# EAGLE design Suport 0.1 (EAGLE 9.6.2)
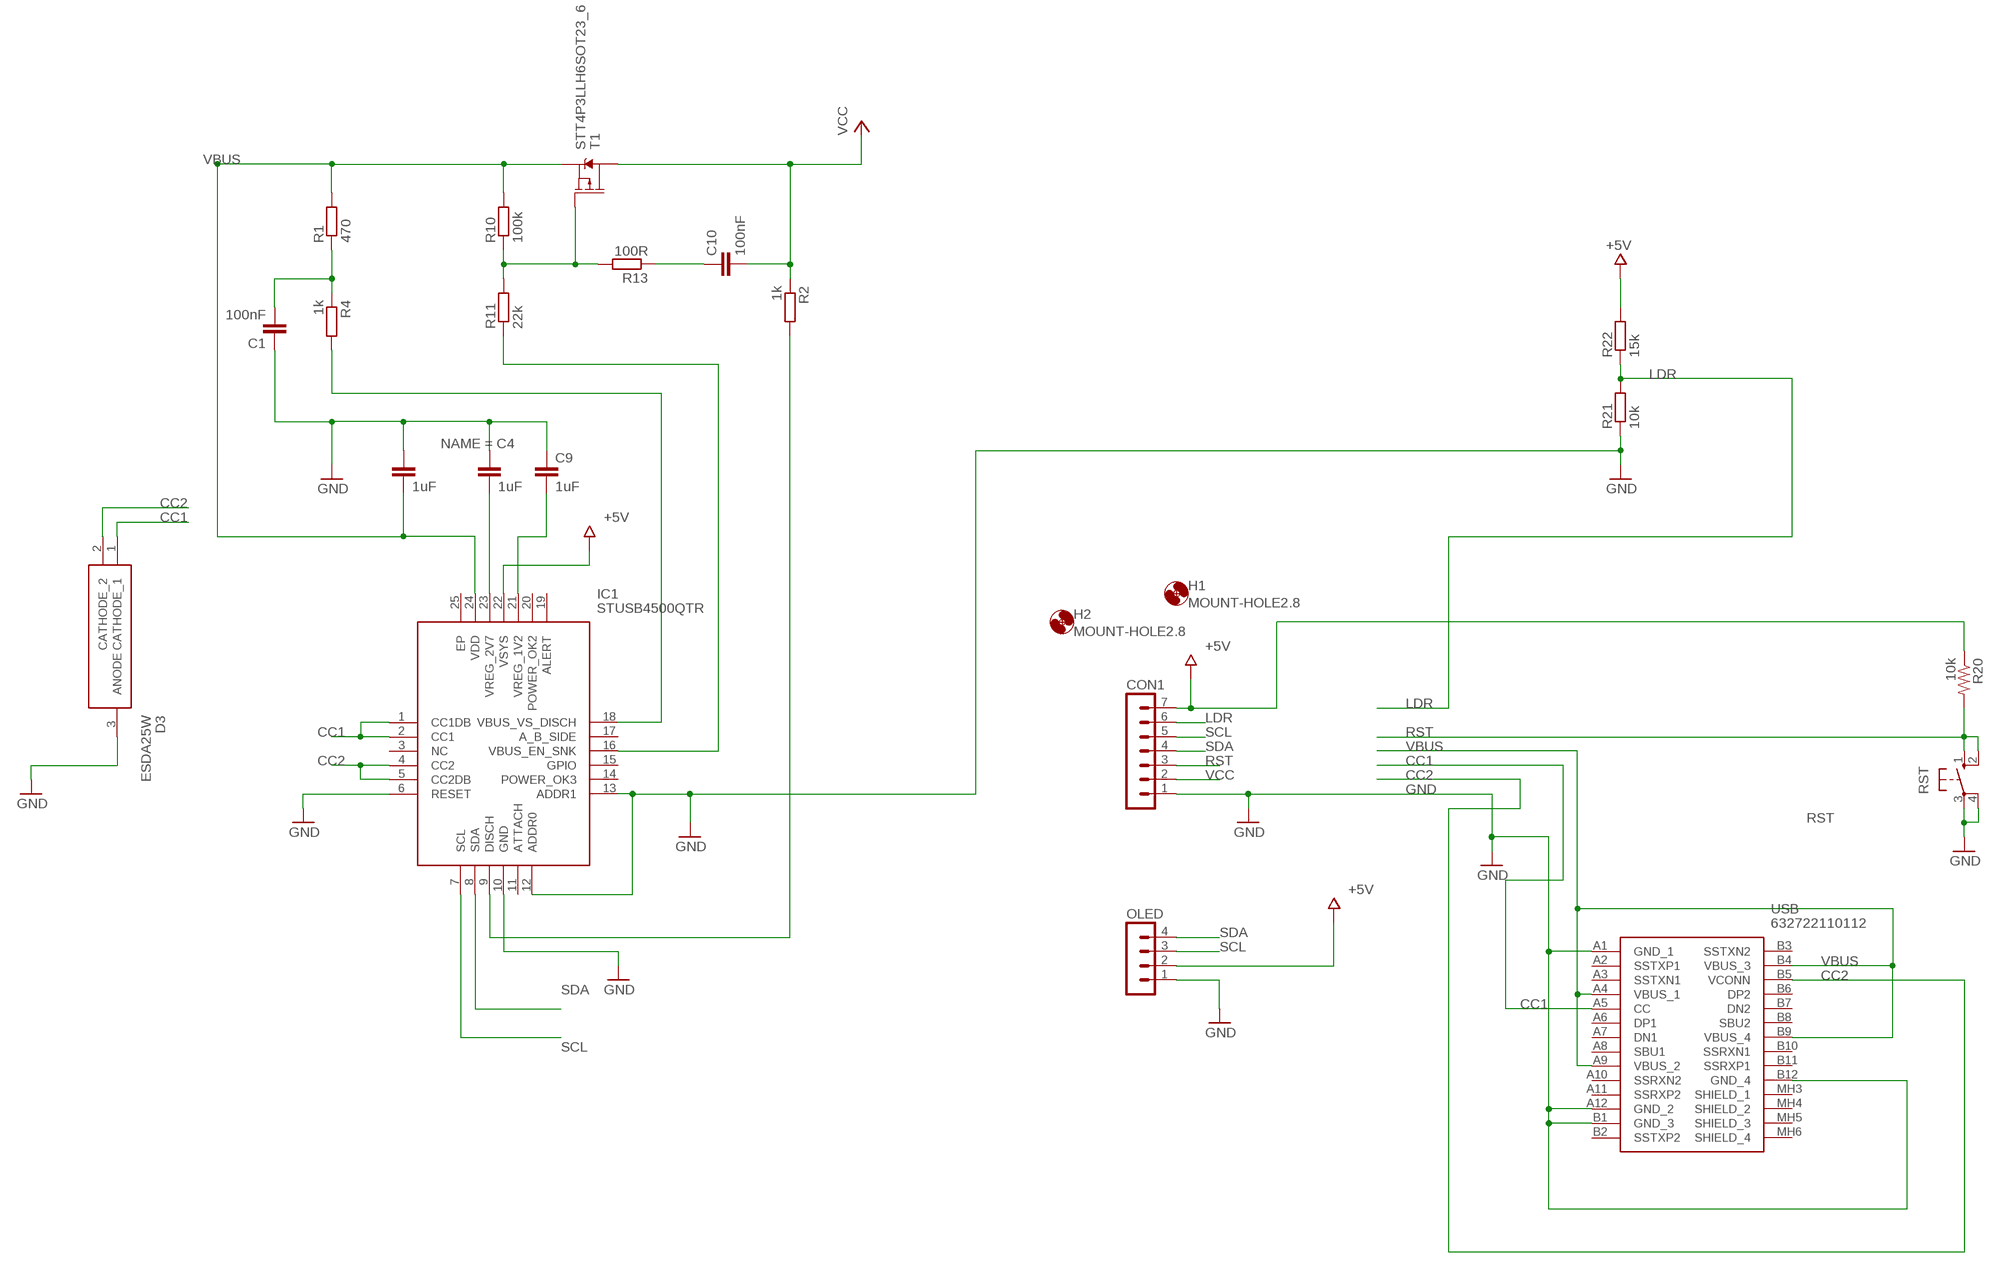
[diagram p0: schematic, sheet 1]

## Parts
C1  100nF  C-EUC0402  [C0402]
C3  1uF  C-EUC0603  [C0603]
C4  1uF  C-EUC0603  [C0603]
C9  1uF  C-EUC0603  [C0603]
C10  100nF  C-EUC0402  [C0402]
CON1  MA07-1  [MA07-1]
D3  ESDA25W  [SOT65P210X110-3N]
H1  MOUNT-HOLE2.8  [2,8]
H2  MOUNT-HOLE2.8  [2,8]
IC1  STUSB4500QTR  [QFN50P400X400X100-25N]
OLED  MA04-1  [MA04-1]
R1  470  R-EU_R0805  [R0805]
R2  1k  R-EU_R0805  [R0805]
R4  1k  R-EU_R0805  [R0805]
R10  100k  R-EU_R0805  [R0805]
R11  22k  R-EU_R0805  [R0805]
R13  100R  R-EU_R0805  [R0805]
R20  10k  R-US_M0805  [M0805]
R21  10k  R-EU_M0805  [M0805]
R22  15k  R-EU_0204/2V  [0204V]
RST  10-XX  [B3F-10XX]
T1  STT4P3LLH6SOT23_6  [SOT23-6]
USB  632722110112  [632722110112]

## Nets
+5V [pwr]: CON1.7 IC1.22(VSYS) OLED.2 R20.1 R22.2
CC1: D3.1(CATHODE_1) IC1.1(CC1DB) IC1.2(CC1) USB.A5(CC)
CC2: D3.2(CATHODE_2) IC1.4(CC2) IC1.5(CC2DB) USB.B5(VCONN)
GND: C1.1 C3.1 C4.1 C9.1 CON1.1 D3.3(ANODE) IC1.6(RESET) IC1.10(GND) IC1.12(ADDR0) IC1.13(ADDR1) OLED.1 R21.1 RST.3(P) RST.4(P1) USB.A1(GND_1) USB.A12(GND_2) USB.B1(GND_3) USB.B12(GND_4)
LDR: CON1.6 R21.2 R22.1
N$3: C1.2 R1.1 R4.1
N$11: R10.1 R11.2 R13.2 T1.3(G)
N$13: C10.1 R13.1
N$17: IC1.16(VBUS_EN_SNK) R11.1
N$21: IC1.9(DISCH) R2.2
N$22: IC1.18(VBUS_VS_DISCH) R4.2
RST: CON1.3 R20.2 RST.1(S) RST.2(S1)
SCL: CON1.5 IC1.7(SCL) OLED.3
SDA: CON1.4 IC1.8(SDA) OLED.4
VBUS: C3.2 IC1.24(VDD) R1.2 R10.2 T1.4(S) USB.A4(VBUS_1) USB.A9(VBUS_2) USB.B4(VBUS_3) USB.B9(VBUS_4)
VCC [pwr]: C10.2 CON1.2 R2.1 T1.1(D) T1.2(D) T1.5(D) T1.6(D)
VREG_1V2: C9.2 IC1.21(VREG_1V2)
VREG_2V7: C4.2 IC1.23(VREG_2V7)
Unconnected: IC1.3(NC) IC1.11(ATTACH) IC1.14(POWER_OK3) IC1.15(GPIO) IC1.17(A_B_SIDE) IC1.19(ALERT) IC1.20(POWER_OK2) IC1.25(EP) USB.A2(SSTXP1) USB.A3(SSTXN1) USB.A6(DP1) USB.A7(DN1) USB.A8(SBU1) USB.A10(SSRXN2) USB.A11(SSRXP2) USB.B2(SSTXP2) USB.B3(SSTXN2) USB.B6(DP2) USB.B7(DN2) USB.B8(SBU2) USB.B10(SSRXN1) USB.B11(SSRXP1) USB.MH3(SHIELD_1) USB.MH4(SHIELD_2) USB.MH5(SHIELD_3) USB.MH6(SHIELD_4)

## Library data of the parts
C1 C10 = rcl:C-EU: CAPACITOR, European symbol; MOUSER_PART_NUMBER: 710-885012205050; SPICEPREFIX: C
C3 C4 = rcl:C-EU: CAPACITOR, European symbol; MOUSER_PART_NUMBER: 81-GRM155R61E105KA2D; SPICEPREFIX: C
C9 = rcl:C-EU: CAPACITOR, European symbol; SPICEPREFIX: C
CON1 = con-lstb:MA07-1: PIN HEADER; OC_FARNELL: unknown; OC_NEWARK: unknown
D3 = SamacSys_Parts:ESDA25W: STMicroelectronics ESDA25W Dual Uni-Directional TVS Diode Array, 400W peak, 3-Pin SOT-323 Source: Datasheet <https://componentsearchengine.com/Datasheets/1/ESDA25W.pdf>; DESCRIPTION: STMicroelectronics ESDA25W Dual Uni-Directional TVS Diode Array, 400W peak, 3-Pin SOT-323; HEIGHT: 1.1mm; MANUFACTURER_NAME: STMicroelectronics; MANUFACTURER_PART_NUMBER: ESDA25W; MOUSER_PART_NUMBER: 511-ESDA25W; MOUSER_PRICE-STOCK: https://www.mouser.com/Search/Refine.aspx?Keyword=511-ESDA25W
H1 H2 = holes:MOUNT-HOLE: MOUNTING HOLE with drill center marker
IC1 = SamacSys_Parts:STUSB4500QTR: USB Interface IC CONDITIONING & INTERFACES Source: Datasheet <https://componentsearchengine.com/Datasheets/1/STUSB4500QTR.pdf>; DESCRIPTION: USB Interface IC CONDITIONING & INTERFACES; HEIGHT: 1mm; MANUFACTURER_NAME: STMicroelectronics; MANUFACTURER_PART_NUMBER: STUSB4500QTR; MOUSER_PART_NUMBER: 511-STUSB4500QTR; MOUSER_PRICE-STOCK: https://www.mouser.com/Search/Refine.aspx?Keyword=511-STUSB4500QTR
OLED = con-lstb:MA04-1: PIN HEADER; OC_FARNELL: unknown; OC_NEWARK: unknown
R1 R2 R4 R10 R11 R13 = rcl:R-EU_: RESISTOR, European symbol; SPICEPREFIX: R
R20 = adafruit:R-US_: RESISTOR, American symbol
R21 R22 = resistor:R-EU_: RESISTOR, European symbol
RST = switch-omron:10-XX: OMRON SWITCH; MPN: B3F-1000; OC_FARNELL: 176432; OC_NEWARK: 36M3542
T1 = STT4P3LLH6:STT4P3LLH6; AVAILABILITY: Unavailable; DESCRIPTION: P-Channel 30 V, 0.048 Ohm typ., 4 A STripFET H6 Power MOSFET in a SOT23-6L package; MF: STMicroelectronics; MP: STT4P3LLH6; PACKAGE: SOT-23-6 STMicroelectronics; PRICE: None
USB = SamacSys_Parts:632722110112: USB Connectors WR-COM SMT Vertical Black Source: Datasheet; DESCRIPTION: USB Connectors WR-COM SMT Vertical Black; HEIGHT: 7.4mm; MANUFACTURER_NAME: Wurth Elektronik; MANUFACTURER_PART_NUMBER: 632722110112; MOUSER_PART_NUMBER: 710-632722110112; MOUSER_PRICE-STOCK: https://www.mouser.co.uk/ProductDetail/Wurth-Elektronik/632722110112?qs=2WXlatMagcH6zbfYjgLonA%3D%3D

## Module TUBEIN16
Ports: 

### Library data of the parts

## Net classes
0 default: width 0.254 mm, clearance 0.254 mm
1 pwr: width 0.254 mm, clearance 0.205 mm to class 0, clearance 0.356 mm

## Board
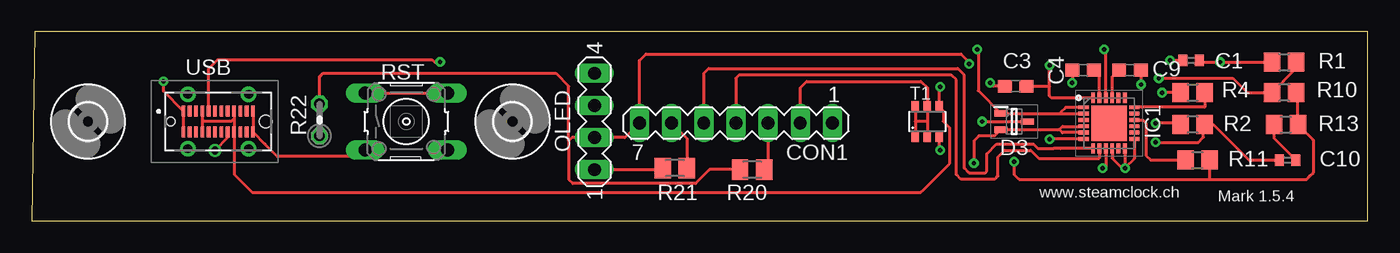
[diagram p1: board, top side]
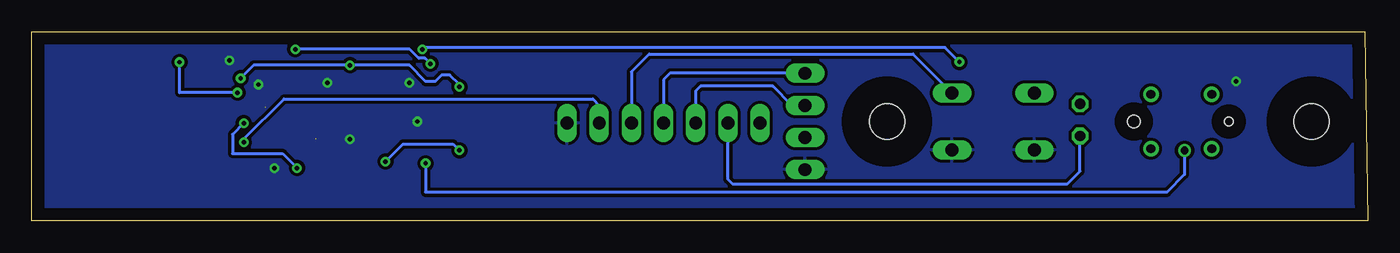
[diagram p2: board, bottom side, seen from below]

Size 105.54 x 14.99 mm. Coordinates in mm from the lower left corner, seen from the top.
Outline: 0.25,14.99 0,0 105.54,0 105.54,14.99 0.25,14.99
Copper layers (1*16): Top 0.035mm / dielectric 1.5mm / Bottom 0.035mm
Design rules "default *": minimum track width 6mil, minimum drill 0.35mm, track to track 4mil, track to pad 6mil, pad to pad 6mil, via to via 6mil, smd to smd 6mil, copper to edge 40mil, drill to drill 6mil, minimum pad ring 10mil, minimum via ring 8mil, stop-mask expansion 4mil, vias tented up to drill 0mil, thermal gap 10mil

### Footprints (pad centres in the part's own frame; a part is rotated, then mirrored left to right if it is on the bottom)
C0402 = smd 0.7 x 0.9: 1 -0.65,0; 2 0.65,0
C0603 = smd 1.1 x 1: 1 -0.85,0; 2 0.85,0
MA07-1 = drill 1.016 long: 1 -7.62,0; 2 -5.08,0; 3 -2.54,0; 4 0,0; 5 2.54,0; 6 5.08,0; 7 7.62,0
SOT65P210X110-3N = smd 1.05 x 0.5: 1 -1.05,0.65; 2 -1.05,-0.65; 3 1.05,0
2,8 = hole 2.8: 0,0
QFN50P400X400X100-25N = smd 0.8 x 0.3: 1 -2,1.25; 2 -2,0.75; 3 -2,0.25; 4 -2,-0.25; 5 -2,-0.75; 6 -2,-1.25; 13 2,-1.25; 14 2,-0.75; 15 2,-0.25; 16 2,0.25; 17 2,0.75; 18 2,1.25 | smd 0.3 x 0.8: 7 -1.25,-2; 8 -0.75,-2; 9 -0.25,-2; 10 0.25,-2; 11 0.75,-2; 12 1.25,-2; 19 1.25,2; 20 0.75,2; 21 0.25,2; 22 -0.25,2; 23 -0.75,2; 24 -1.25,2 | smd 2.8 x 2.8: 25 0,0
MA04-1 = drill 1.016 long: 1 -3.81,0; 2 -1.27,0; 3 1.27,0; 4 3.81,0
R0805 = smd 1.3 x 1.5: 1 -0.95,0; 2 0.95,0
M0805 = smd 1.3 x 1.6: 1 -0.95,0; 2 0.95,0
0204V = drill 0.813 octagon: 1 -1.27,0; 2 1.27,0
B3F-10XX = drill 1.016 long: 1 -3.251,2.261; 2 3.251,2.261; 3 -3.251,-2.261; 4 3.251,-2.261
SOT23-6 = smd 0.6 x 0.9: 1 -0.95,-1.15; 2 0,-1.15; 3 0.95,-1.15; 4 0.95,1.15; 5 0,1.15; 6 -0.95,1.15
632722110112 = smd 0.3 x 0.85: A1 -2.75,0.83; A2 -2.25,0.83; A3 -1.75,0.83; A4 -1.25,0.83; A5 -0.75,0.83; A6 -0.25,0.83; A7 0.25,0.83; A8 0.75,0.83; A9 1.25,0.83; A10 1.75,0.83; A11 2.25,0.83; A12 2.75,0.83; B1 2.75,-0.83; B2 2.25,-0.83; B3 1.75,-0.83; B4 1.25,-0.83; B5 0.75,-0.83; B6 0.25,-0.83; B7 -0.25,-0.83; B8 -0.75,-0.83; B9 -1.25,-0.83; B10 -1.75,-0.83; B11 -2.25,-0.83; B12 -2.75,-0.83 | drill 0.7 pad 1.2: MH3 -2.4,2.15; MH4 2.4,2.15; MH5 -2.4,-2.15; MH6 2.4,-2.15 | hole 0.66: -3.75,0 | hole 1: 3.75,0

### Placement (x,y rotation side)
C1  91.57,12.7 0 top
C3  77.72,10.67 0 top
C4  83.06,11.94 0 top
C9  86.74,11.94 180 top
C10  99.19,4.83 180 top
CON1  55.63,7.75 180 top
D3  77.6,7.87 0 top
H1  4.45,7.87 0 top
H2  37.97,7.87 0 top
IC1  85.09,7.75 0 top
OLED  44.45,7.87 90 top
R1  98.93,12.57 0 top
R2  91.69,7.62 180 top
R4  91.69,10.16 0 top
R10  98.93,10.16 180 top
R11  92.07,4.83 0 top
R13  99.06,7.62 0 top
R20  56.9,4.06 0 top
R21  50.8,4.19 0 top
R22  22.73,8 90 top
RST  29.59,7.87 0 top
T1  70.74,7.87 0 top
USB  14.73,7.87 0 top

### Tracks (layer width: path | path; a pad name or v marks a point on that pad's centre or on a via)
+5V  (via drill 0.35)
  Top 0.254: R22.2 22.73,11.43 22.99,11.68 41.4,11.68 42.42,10.67 42.42,6.35 | R20.1 53.54,4.06 52.45,2.97 42.75,2.97 42.42,3.3 42.42,6.35 | 42.42,6.35 42.67,6.6 OLED.2 46.86,6.6 CON1.7 48.01,12.7 48.51,13.21 73.41,13.21 74.04,12.57 v74.04,12.45 | v84.71,13.59 84.84,13.46 IC1.22
  Bottom 0.254: v74.04,12.45 74.48,12.88 74.97,12.88 75.68,13.59 v84.71,13.59
CC1  (via drill 0.35)
  Top 0.254: IC1.1 81.68,9 | 81.68,9 81.66,9.02 | IC1.2 81.29,8.5 81.27,8.52 | 81.27,8.52 D3.1 74.77,10.3 74.77,13.5 v74.68,13.59 | 81.68,9 81.27,8.58 81.27,8.52 | USB.A5 13.98,12.06 14.68,12.76 31.62,12.76 31.81,12.58 v32.26,12.58
  Bottom 0.254: v32.26,12.58 33.4,13.72 74.55,13.72 v74.68,13.59
CC2  (via drill 0.35, 0.61)
  Top 0.254: USB.B5 15.48,6.59 v14.48,5.59 | IC1.4 81.41,7.5 81.16,7.24 | IC1.5 81.42,7 | 81.42,7 81.41,6.99 | 81.16,7.24 76.57,7.24 D3.2 76.05,6.73 74.8,6.73 74.42,6.35 v74.42,4.57 | 81.42,7 81.4,7 81.16,7.24
  Bottom 0.254: v14.48,5.59 14.48,3.68 15.88,2.29 74.42,2.29 v74.42,4.57
GND  (via drill 0.35)  (1 unrouted)
  Top 0.254: USB.B1 17.48,6.76 | 17.48,8.99 USB.A12 USB.B1 | 11.98,6.9 USB.B12 USB.A1 10.41,10.27 v10.41,11.05 | USB.B1 18.41,6.11 18.41,6.1 19.41,5.1 25.83,5.1 RST.3 | 83.07,6.48 v80.39,6.48 | v75.06,7.87 D3.3 | IC1.10 85.34,4.95 86.11,4.19 v86.36,4.19 | IC1.12 86.36,5.73 v86.36,4.19 | IC1.13 87.09,4.92 v86.36,4.19 | C4.1 82.21,10.96 v82.17,10.92 | C3.1 75.95,10.67 v75.69,10.92 | 46.74,4.06 OLED.1 49.72,4.06 R21.1 | C9.1 87.59,10.83 v87.63,10.79 | C1.1 v89.92,12.7
  Bottom 0.254: v80.39,6.48
  pour Bottom: -35.31,14.86 -35.31,0.38 108.33,0.38 108.33,14.86
LDR
  Top 0.254: CON1.6 51.75,6.54 R21.2
  Bottom 0.254: CON1.6 50.55,3.3 50.16,2.92 23.75,2.92 22.73,3.94 R22.1
N$3  (via drill 0.35)
  Top 0.254: C1.2 92.33,12.7 92.46,12.57 v93.85,12.57 R1.1 | R4.1 v89.28,10.16
  Bottom 0.254: v89.28,10.16 93.85,10.16 v93.85,12.57
N$11  (via drill 0.35)
  Top 0.254: R10.1 100.01,10.03 R13.2 101.22,6.41 101.22,3.81 100.96,3.56 100.84,3.43 100.71,3.3 93.02,3.3 | R11.2 93.02,3.43 93.02,3.3 | 93.02,3.3 77.98,3.3 77.6,3.68 v77.6,4.7 | v71.75,5.59 71.69,5.65 T1.3
  Bottom 0.254: v77.6,4.7 76.2,6.1 72.26,6.1 v71.75,5.59
N$13
  Top 0.254: R13.1 98.11,6.55 C10.1
N$17
  Top 0.254: R11.1 88.39,4.83 88.01,5.21 88.01,7.75 87.76,8 IC1.16
N$21  (via drill 0.35)
  Top 0.254: R2.2 90.62,7.75 v88.77,7.75 | IC1.9 84.84,4.19 v84.58,4.19
  Bottom 0.254: v84.58,4.19 85.72,5.33 89.66,5.33 89.66,6.86 v88.77,7.75
N$22  (1 unrouted)
  Top 0.254: R4.2 92.64,9.02 87.66,9.02 87.65,9.03 87.09,9.03
RST
  Top 0.254: RST.1 RST.2 | CON1.3 58.17,4.38 R20.2
  Bottom 0.254: RST.2 35.92,13.21 56.77,13.21 58.17,11.81 CON1.3
SCL
  Top 0.254: IC1.7 81.31,5.75 | 81.31,5.75 81.28,5.71 | 81.31,5.75 80.73,5.75 80.7,5.72 79.49,5.72 79.12,6.1 76.21,6.1 75.44,5.32 75.44,3.94 75.31,3.81 74.04,3.81 73.66,4.19 73.66,11.56 73.15,12.06 53.47,12.06 53.09,11.68 CON1.5
  Bottom 0.254: OLED.3 45.47,9.14 46.99,10.67 52.7,10.67 53.09,10.29 CON1.5
SDA
  Top 0.254: IC1.8 84.33,5.74 84.33,4.95 79.55,4.95 78.91,5.59 76.83,5.59 76.33,5.08 76.33,3.56 76.07,3.3 73.41,3.3 73.02,3.68 73.02,11.18 72.64,11.56 55.88,11.56 55.63,11.3 CON1.4
  Bottom 0.254: OLED.4 55.12,11.68 55.63,11.18 CON1.4
VBUS  (via drill 0.35)
  Top 0.254: USB.A4 13.48,7.87 | 13.48,7.87 USB.B9 | USB.A9 15.98,8 | 15.98,8 USB.B4 16,7.02 16,3.68 17.4,2.29 70.23,2.29 72.52,4.57 72.52,7.37 72,7.88 72,8.71 T1.4 71.69,10.61 v71.75,10.61 | 15.98,8 15.89,8 15.79,7.9 13.51,7.9 13.48,7.87 | IC1.24 80.55,9.75 80.39,9.91 80.39,10.67 | 80.39,10.67 v80.39,12.32 | C3.2 80.39,10.67 | v89.03,11.3 94.87,11.3 96.01,10.16 R10.2 98.85,11.03 98.85,11.07 99.88,12.1 R1.2
  Bottom 0.254: v89.03,11.3 88.01,12.32 v80.39,12.32 75.69,12.32 74.42,11.05 73.66,11.05 73.15,11.56 72.52,11.56 71.75,10.79 v71.75,10.61
VCC  (via drill 0.35)
  Top 0.254: 70.74,7.87 T1.5 70.74,10.54 70.23,11.05 61.21,11.05 60.71,10.54 CON1.2 60.71,8.51 | 70.74,7.87 T1.2 | T1.6 69.79,7.87 | 69.79,7.87 T1.1 | 70.74,7.87 69.79,7.87 | C10.2 96.14,4.83 93.34,7.62 R2.1 92.55,7.53 92.55,6.64 92.14,6.22 v88.77,6.22
  Bottom 0.254: CON1.2 60.71,9.14 61.21,9.65 85.6,9.65 88.77,6.48 v88.77,6.22
VREG_1V2
  Top 0.254: IC1.21 85.34,11.39 C9.2
VREG_2V7
  Top 0.254: IC1.23 84.33,9.76 84.33,11.52 C4.2

### Text on the board
tNames: www.steamclock.ch | Mark 1.5.4